# EAGLE design v1 (EAGLE 7.3.0)
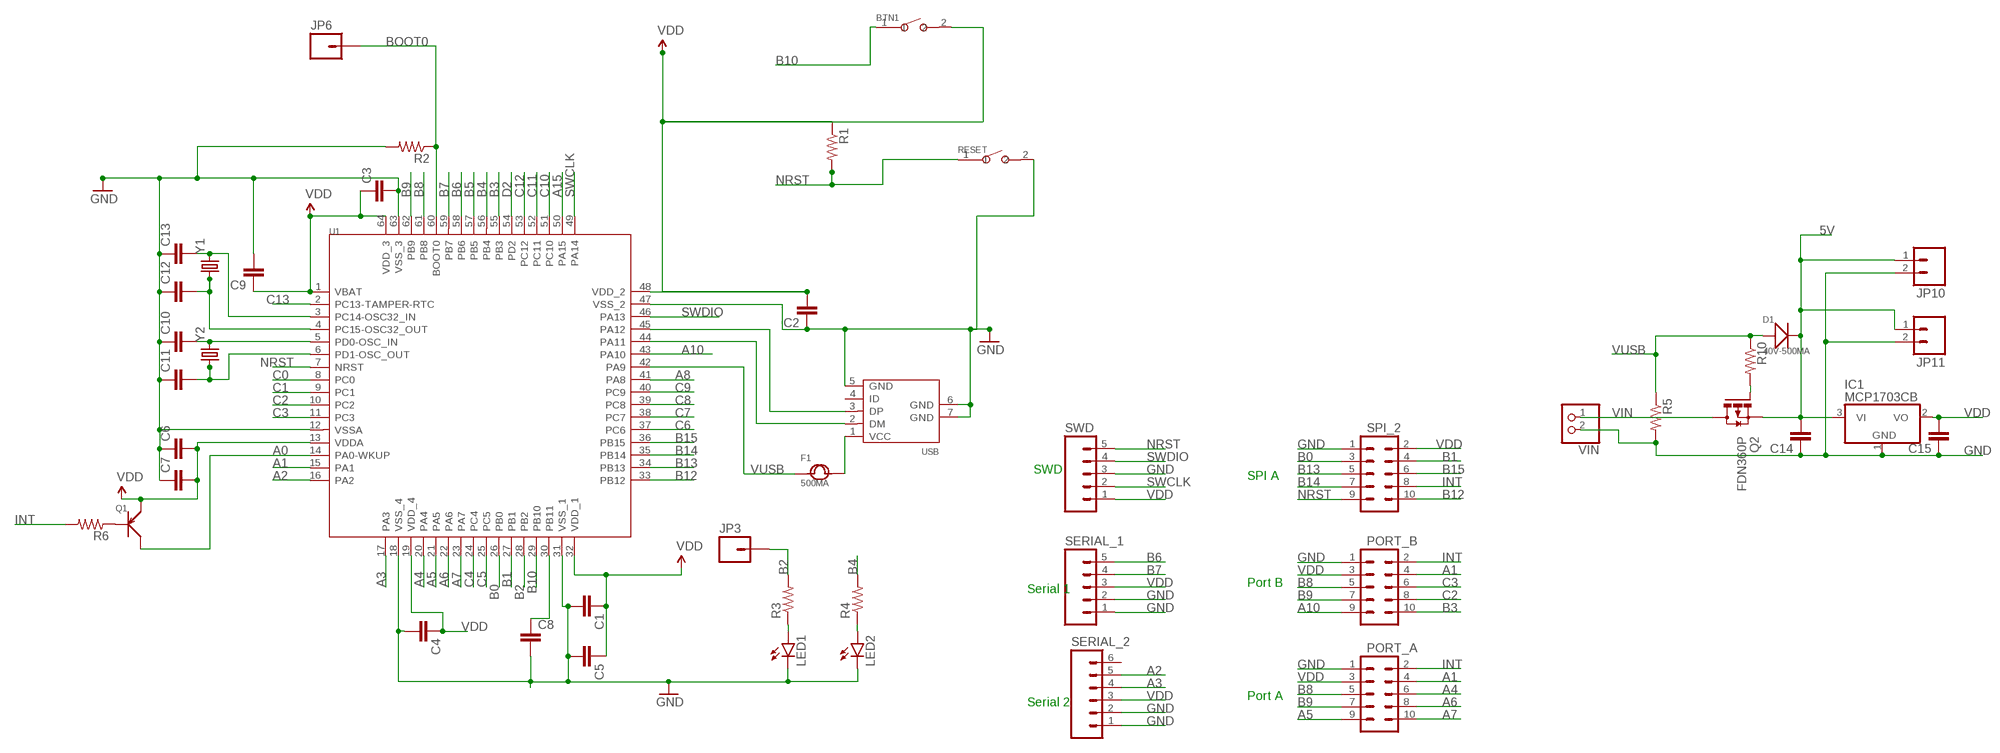
[diagram p0: schematic, sheet 1]

## Parts
BTN1  SMD-BUTTON(2P-6.0X3.0X2.5MM)-DHT-1163S  [SW2-4.0-6.0X3.0X2.5MM]
C1  CAP0805  [0805]
C2  CAP0805  [0805]
C3  CAP0805  [0805]
C4  CAP0805  [0805]
C5  CAP0805  [0805]
C6  CAP0805  [0805]
C7  CAP0805  [0805]
C8  CAP0805  [0805]
C9  CAP0805  [0805]
C10  CAP0805  [0805]
C11  CAP0805  [0805]
C12  CAP0805  [0805]
C13  CAP0805  [0805]
C14  CAP0805  [0805]
C15  CAP0805  [0805]
D1  40V-500MA  SMD-DIODE-SCHOTTKY-40V-500MA(SOD-123)  [SOD-123]
F1  500MA  SMD-PPTC-500MA(1206)  [F1206]
IC1  MCP1703CB  [SOT23]
JP3  M01NOSILK-KIT  [1X01NS-KIT]
JP6  M01NOSILK-KIT  [1X01NS-KIT]
JP10  M02PTH  [1X02]
JP11  M02PTH  [1X02]
LED1  LED1206  [LED-1206]
LED2  LED1206  [LED-1206]
PORT_A  M05X2PTH  [AVR_ICSP]
PORT_B  M05X2PTH  [AVR_ICSP]
Q1  SMD-TRANSISTORS-PNP-25V-500MA(SOT-23)  [SOT-23]
Q2  FDN360P  [SUPER-SOT3]
R1  RESISTOR0805-RES  [0805]
R2  RESISTOR0805-RES  [0805]
R3  RESISTOR0805-RES  [0805]
R4  RESISTOR0805-RES  [0805]
R5  RESISTOR0805-RES  [0805]
R6  RESISTOR0805-RES  [0805]
R10  RESISTOR0805-RES  [0805]
RESET  SMD-BUTTON(2P-6.0X3.0X2.5MM)-DHT-1163S  [SW2-4.0-6.0X3.0X2.5MM]
SERIAL_1  M051.27MM  [1X05-1.27MM]
SERIAL_2  M06SILK_FEMALE_PTH  [1X06]
SPI_2  M05X2PTH  [AVR_ICSP]
SWD  M051.27MM  [1X05-1.27MM]
U1  MCU-STM32F401RBT6(LQFP64)  [LQFP64-0.5-10X10MM]
USB  MICRO-USB-SMD-TYPE-AB-R/A(ST-USB-001L)  [MICRO-USB5+2P-SMD-0.65]
VIN  JST_2PIN-SMT-RA  [JST-PH-2-SMT-RA]
Y1  CRYSTAL5X3  [CRYSTAL-SMD-5X3]
Y2  CRYSTAL5X3  [CRYSTAL-SMD-5X3]

## Nets
5V: C14.2 D1.- IC1.3(VI) JP10.1 JP11.1 Q2.2(S)
A0: Q1.3(C) U1.14(PA0-WKUP)
A1: PORT_A.4 PORT_B.4 U1.15(PA1)
A2: SERIAL_2.5 U1.16(PA2)
A3: SERIAL_2.4 U1.17(PA3)
A4: PORT_A.6 U1.20(PA4)
A5: PORT_A.9 U1.21(PA5)
A6: PORT_A.8 U1.22(PA6)
A7: PORT_A.10 U1.23(PA7)
A8: U1.41(PA8)
A10: PORT_B.9 U1.43(PA10)
A15: U1.50(PA15)
B0: SPI_2.3 U1.26(PB0)
B1: SPI_2.4 U1.27(PB1)
B2: JP3.1 R3.2 U1.28(PB2)
B3: PORT_B.10 U1.55(PB3)
B4: R4.2 U1.56(PB4)
B5: U1.57(PB5)
B6: SERIAL_1.5 U1.58(PB6)
B7: SERIAL_1.4 U1.59(PB7)
B8: PORT_A.5 PORT_B.5 U1.61(PB8)
B9: PORT_A.7 PORT_B.7 U1.62(PB9)
B10: BTN1.1 U1.29(PB10)
B12: SPI_2.10 U1.33(PB12)
B13: SPI_2.5 U1.34(PB13)
B14: SPI_2.7 U1.35(PB14)
B15: SPI_2.6 U1.36(PB15)
BOOT0: JP6.1 R2.1 U1.60(BOOT0)
C0: U1.8(PC0)
C1: U1.9(PC1)
C2: PORT_B.8 U1.10(PC2)
C3: PORT_B.6 U1.11(PC3)
C4: U1.24(PC4)
C5: U1.25(PC5)
C6: U1.37(PC6)
C7: U1.38(PC7)
C8: U1.39(PC8)
C9: U1.40(PC9)
C10: U1.51(PC10)
C11: U1.52(PC11)
C12: U1.53(PC12)
C13: U1.2(PC13-TAMPER-RTC)
D2: U1.54(PD2)
GND: C1.2 C2.1 C3.2 C4.2 C5.2 C6.1 C7.1 C8.2 C9.2 C10.1 C11.1 C12.1 C13.1 C14.1 C15.1 IC1.1(GND) JP10.2 JP11.2 LED1.C LED2.C PORT_A.1 PORT_B.1 R2.2 R5.2 RESET.2 SERIAL_1.1 SERIAL_1.2 SERIAL_2.1 SERIAL_2.2 SPI_2.1 SWD.3 U1.12(VSSA) U1.18(VSS_4) U1.31(VSS_1) U1.47(VSS_2) U1.63(VSS_3) USB.5(GND) USB.6(GND) USB.7(GND) VIN.2
INT: PORT_A.2 PORT_B.2 R6.2 SPI_2.8
N$1: C13.2 U1.3(PC14-OSC32_IN) Y1.3
N$2: C8.1 U1.30(PB11)
N$3: C12.2 U1.4(PC15-OSC32_OUT) Y1.1
N$4: C10.2 U1.5(PD0-OSC_IN) Y2.3
N$5: C11.2 U1.6(PD1-OSC_OUT) Y2.1
N$6: U1.44(PA11) USB.2(DM)
N$7: U1.45(PA12) USB.3(DP)
N$8: Q1.1(B) R6.1
N$9: F1.2 USB.1(VCC)
N$10: LED1.A R3.1
N$11: LED2.A R4.1
N$14: Q2.1(G) R10.2
NRST: R1.2 RESET.1 SPI_2.9 SWD.5 U1.7(NRST)
SWCLK: SWD.2 U1.49(PA14)
SWDIO: SWD.4 U1.46(PA13)
VDD: BTN1.2 C1.1 C2.2 C3.1 C4.1 C5.1 C6.2 C7.2 C9.1 C15.2 IC1.2(VO) PORT_A.3 PORT_B.3 Q1.2(E) R1.1 SERIAL_1.3 SERIAL_2.3 SPI_2.2 SWD.1 U1.1(VBAT) U1.13(VDDA) U1.19(VDD_4) U1.32(VDD_1) U1.48(VDD_2) U1.64(VDD_3)
VIN: Q2.3(D) VIN.1
VUSB: D1.+ F1.1 R5.1 R10.1 U1.42(PA9)
Unconnected: SERIAL_2.6 USB.4(ID)

## Notes on the sheet
- SWD
- SPI A
- Port B
- Serial 1
- Port A
- Serial 2

## Library data of the parts
BTN1 RESET = Seeed-OPL-Switch:SMD-BUTTON(2P-6.0X3.0X2.5MM): 311020029
C1-C15 = SparkFun-Passives:CAP: Capacitor Standard 0603 ceramic capacitor, and 0.1" leaded capacitor.
D1 = Seeed-OPL-Diode:SMD-DIODE-SCHOTTKY-40V-500MA(SOD-123): 304020012; MPN: B0540W
F1 = Seeed-OPL-fuse:SMD-PPTC-500MA(1206): 307010002
IC1 = linear:MCP1703: 250 mA, 16V, Low Quiescent Current LDO Regulator Source: http://ww1.microchip.com/downloads/en/DeviceDoc/22049b.pdf
JP3 JP6 = SparkFun-Connectors:M01: Header 1 Standard 1-pin 0.1" header. Use with straight break away headers (SKU : PRT-00116), right angle break away headers (PRT-00553), swiss pins (PRT-00743), machine pins (PRT-00117), and female headers (PRT-00115).
JP10 JP11 = SparkFun-Connectors:M02: Standard 2-pin 0.1" header. Use with - straight break away headers ( PRT-00116) - right angle break away headers (PRT-00553) - swiss pins (PRT-00743) - machine pins (PRT-00117) - female headers (PRT-00115) Molex polarized connector foot print use with: PRT-08233 with associated crimp pins and housings. 2.54_SCREWTERM for use with PRT-10571. 3.5mm Screw Terminal footprints for PRT-08084 5mm Screw Terminal footprints for use with PRT-08432
LED1 LED2 = SparkFun-LED:LED: LEDs Standard schematic elements and footprints for 5mm, 3mm, 1206, and 0603 sized LEDs. 5mm - Spark Fun Electronics SKU : COM-00529 (and others)
PORT_A PORT_B SPI_2 = SparkFun-Connectors:M05X2: Header 5x2 Standard 10-pin dual row 0.1" header. Commonly used with AVR-ISP. Use with Spark Fun Electronics SKU: PRT-00778
Q1 = Seeed-OPL-Transistor:SMD-TRANSISTORS-PNP-25V-500MA(SOT-23): 305020006; MPN: S8550
Q2 = transistor-power:FDN360P: Single P-Channel, PowerTrench (R) MOSFET Source: http://www.fairchildsemi.com/ds/FD/FDN360P.pdf
R1-R6 R10 = SparkFun-Passives:RESISTOR: Resistor Basic schematic elements and footprints for 0603, 1206, and PTH resistors.
SERIAL_1 SWD = SparkFun-Connectors:M05: Header 5 Standard 5-pin 0.1" header. Use with straight break away headers (SKU : PRT-00116), right angle break away headers (PRT-00553), swiss pins (PRT-00743), machine pins (PRT-00117), and female headers (PRT-00115). Molex polarized connector foot print use with SKU : PRT-08230 with associated crimp pins and housings.
SERIAL_2 = SparkFun-Connectors:M06: Header 6 Standard 6-pin 0.1" header. Use with straight break away headers (SKU : PRT-00116), right angle break away headers (PRT-00553), swiss pins (PRT-00743), machine pins (PRT-00117), and female headers (PRT-00115). Molex polarized connector foot print use with SKU : PRT-08094 with associated crimp pins and housings. NOTES ON THE VARIANTS LOCK and LOCK_LONGPADS... This footprint was designed to help hold the alignment of a through-hole component (i.e. 6-pin header) while soldering it into place. You may notice that each hole has been shifted either up or down by 0.005 of an inch from it's more standard position (which is a perfectly straight line). This slight alteration caused the pins (the squares in the middle) to touch the edges of the holes. Because they are alternating, it causes a "brace" to hold the component in place. 0.005 has proven to be the perfect amount of "off-center" position when using our standard breakaway headers. Although looks a little odd when you look at the bare footprint, once you have a header in there, the alteration is very hard to notice. Also,if you push a header all the way into place, it is covered up entirely on the bottom side. This idea of altering the position of holes to aid alignment will be further integrated into the Sparkfun Library for other footprints. It can help hold any component with 3 or more connection pins.; PROD_ID: CONN-08437
U1 = Seeed-OPL-ic:MCU-STM32F401RBT6(LQFP64): 310010113; MPN: STM32F401RBT6
USB = Seeed-OPL-Connector:MICRO-USB-SMD-TYPE-AB-R/A(ST-USB-001L): 320010012; MPN: ST-USB-001L
VIN = adafruit:JST_2PIN: JST 2-Pin Connectors of various flavors SMT-RA (S2B-PH-SM4) 4UConnector #17311 SMT (B2B-PH-SM4) THM-RA (S2B-PH) THM (B2B-PH)
Y1 Y2 = SparkFun-FreqCtrl:CRYSTAL: Various standard crystals. Proven footprints.; PROD_ID: XTAL-08218

## Board
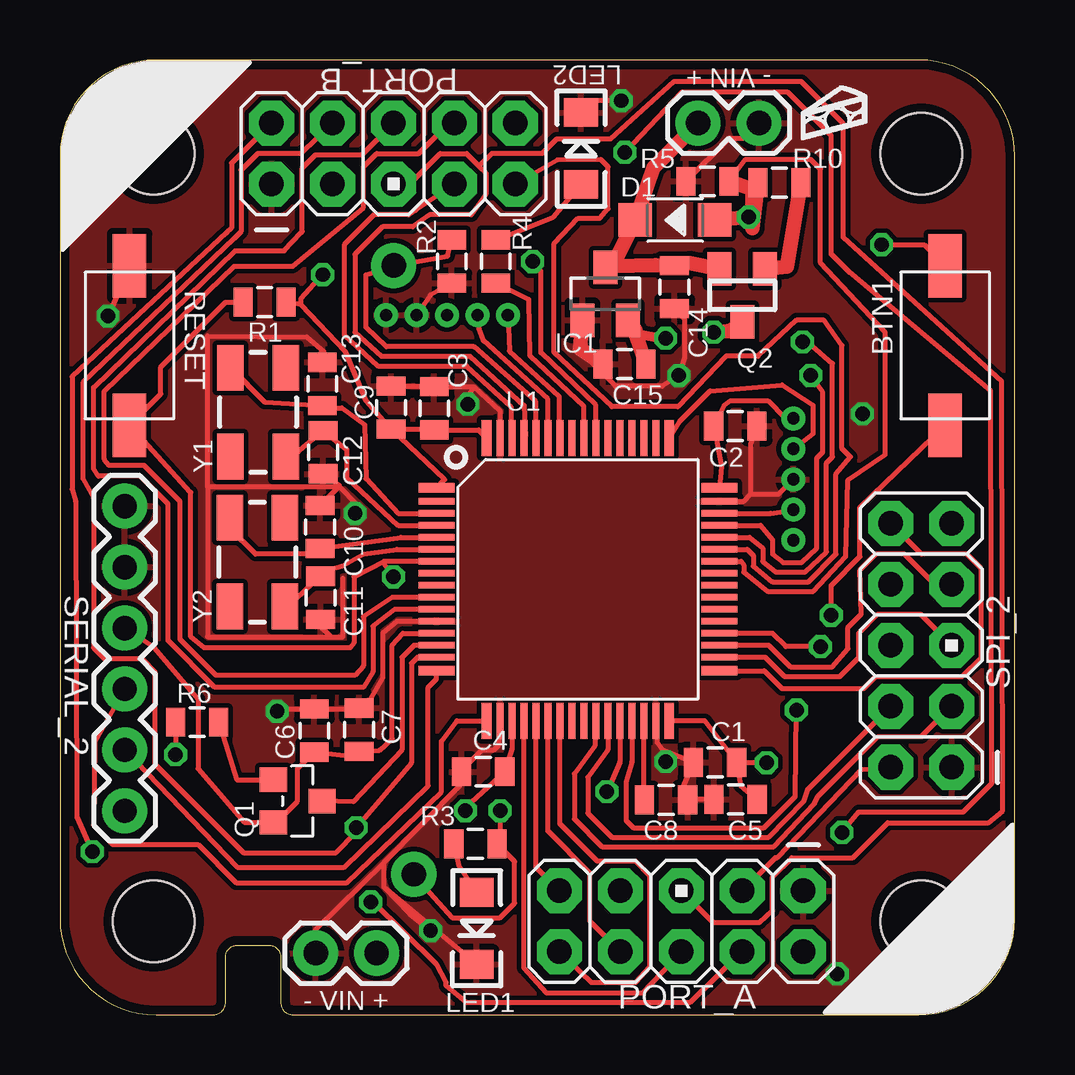
[diagram p1: board, top side]
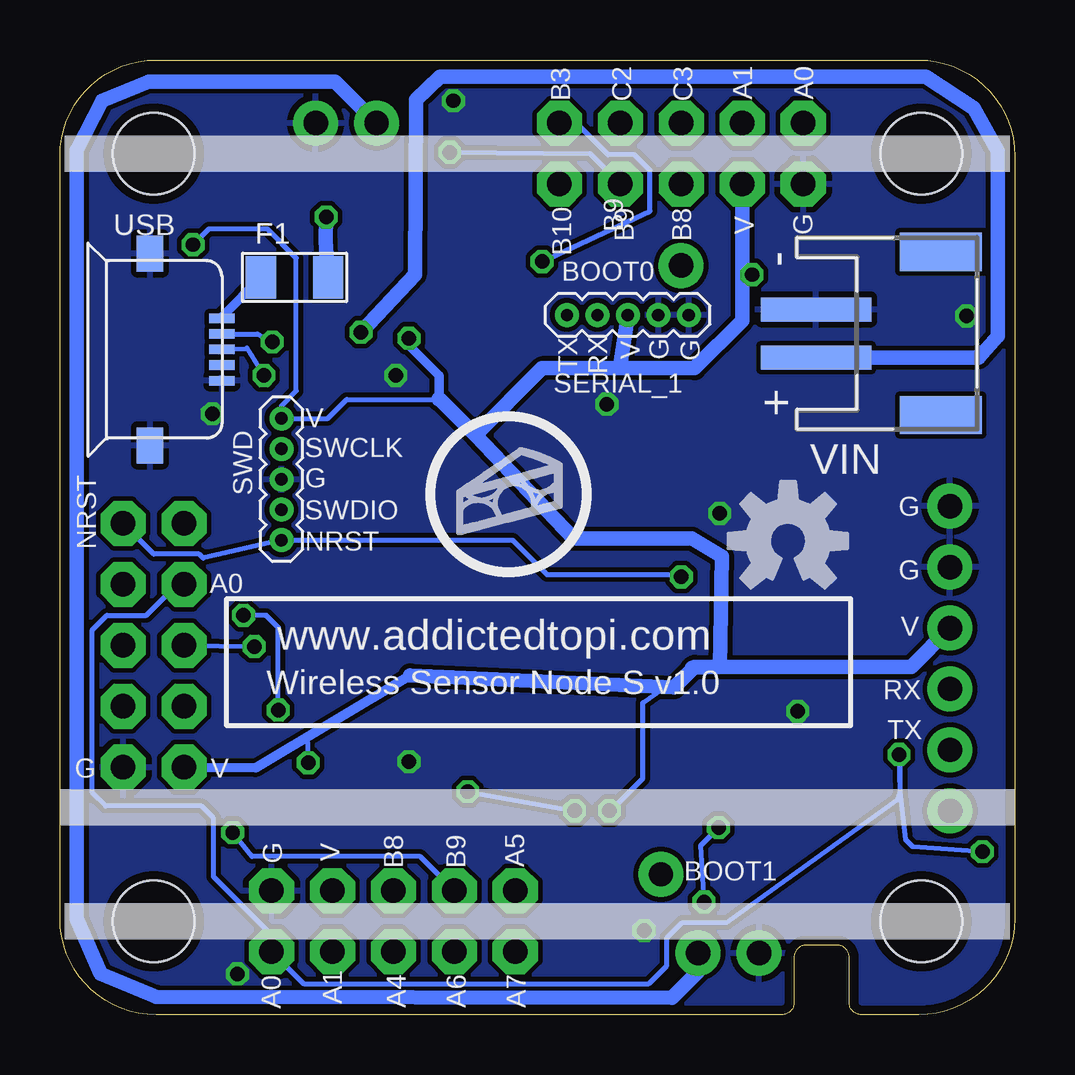
[diagram p2: board, bottom side, seen from below]

Size 39.8 x 39.8 mm. Coordinates in mm from the lower left corner, seen from the top.
Outline: 0,35.8 0,4 arc90 4,0 6.4,0 arc90 6.9,0.5 6.9,2.4 arc-90 7.4,2.9 8.7,2.9 arc-90 9.2,2.4 9.2,0.5 arc90 9.7,0 35.8,0 arc90 39.8,4 39.8,35.8 arc90 35.8,39.8 4,39.8 arc90 0,35.8
Copper layers (1*16): Top 0.0356mm / dielectric 1.5011mm / Bottom 0.0356mm
Design rules "LaenPCBOrder": minimum track width 6mil, minimum drill 13mil, track to track 6mil, track to pad 6mil, pad to pad 6mil, via to via 6mil, smd to smd 6mil, copper to edge 15mil, drill to drill 6mil, minimum pad ring 7mil, minimum via ring 7mil, stop-mask expansion 3mil, vias tented up to drill 0mil, thermal gap 10mil
Holes 3.4 mm at 3.9,3.9 35.9,3.9 35.9,35.9 3.9,35.9

### Footprints (pad centres in the part's own frame; a part is rotated, then mirrored left to right if it is on the bottom)
SW2-4.0-6.0X3.0X2.5MM = smd 2.65 x 1.4: 1 -3.325,0; 2 3.325,0
0805 = smd 0.8 x 1.2: 1 -0.9,0; 2 0.9,0
SOD-123 = smd 1.397 x 1.397: + -1.651,0; - 1.651,0
F1206 = smd 1.27 x 1.778: 1 -1.397,0; 2 1.397,0
SOT23 = smd 1 x 1.4: 1 -0.95,-1.1; 2 0.95,-1.1; 3 0,1.1
1X01NS-KIT = drill 1.016 pad 1.88: 1 0,0
1X02 = drill 1.016 pad 1.88: 1 0,0; 2 2.54,0
LED-1206 = smd 1.2 x 1.4: A -1.5,0; C 1.5,0
AVR_ICSP = drill 1.016 pad 1.88 octagon: 1 -1.27,5.08; 2 1.27,5.08; 3 -1.27,2.54; 4 1.27,2.54; 5 -1.27,0; 6 1.27,0; 7 -1.27,-2.54; 8 1.27,-2.54; 9 -1.27,-5.08; 10 1.27,-5.08
SOT-23 = smd 1.016 x 1.143: 1 -0.889,-1.016; 2 0.889,-1.016; 3 0,1.016
SUPER-SOT3 = smd 1 x 1.4: 1 -0.95,-1.1; 2 0.95,-1.1; 3 0,1.1
1X05-1.27MM = drill 0.508 pad 1: 1 0,0; 2 1.27,0; 3 2.54,0; 4 3.81,0; 5 5.08,0
1X06 = drill 1.016 pad 1.88: 1 0,0; 2 2.54,0; 3 5.08,0; 4 7.62,0; 5 10.16,0; 6 12.7,0
LQFP64-0.5-10X10MM = smd 1.5 x 0.4: 1 -5.9,3.81; 16 -5.9,-3.81; 33 5.9,-3.81; 48 5.9,3.81 | smd 1.5 x 0.28: 2 -5.9,3.25; 3 -5.9,2.75; 4 -5.9,2.25; 5 -5.9,1.75; 6 -5.9,1.25; 7 -5.9,0.75; 8 -5.9,0.25; 9 -5.9,-0.25; 10 -5.9,-0.75; 11 -5.9,-1.25; 12 -5.9,-1.75; 13 -5.9,-2.25; 14 -5.9,-2.75; 15 -5.9,-3.25; 34 5.9,-3.25; 35 5.9,-2.75; 36 5.9,-2.25; 37 5.9,-1.75; 38 5.9,-1.25; 39 5.9,-0.75; 40 5.9,-0.25; 41 5.9,0.25; 42 5.9,0.75; 43 5.9,1.25; 44 5.9,1.75; 45 5.9,2.25; 46 5.9,2.75; 47 5.9,3.25 | smd 0.4 x 1.5: 17 -3.81,-5.9; 32 3.81,-5.9; 49 3.81,5.9; 64 -3.81,5.9 | smd 0.28 x 1.5: 18 -3.25,-5.9; 19 -2.75,-5.9; 20 -2.25,-5.9; 21 -1.75,-5.9; 22 -1.25,-5.9; 23 -0.75,-5.9; 24 -0.25,-5.9; 25 0.25,-5.9; 26 0.75,-5.9; 27 1.25,-5.9; 28 1.75,-5.9; 29 2.25,-5.9; 30 2.75,-5.9; 31 3.25,-5.9; 50 3.25,5.9; 51 2.75,5.9; 52 2.25,5.9; 53 1.75,5.9; 54 1.25,5.9; 55 0.75,5.9; 56 0.25,5.9; 57 -0.25,5.9; 58 -0.75,5.9; 59 -1.25,5.9; 60 -1.75,5.9; 61 -2.25,5.9; 62 -2.75,5.9; 63 -3.25,5.9
MICRO-USB5+2P-SMD-0.65 = smd 0.4 x 1.05: 1 -1.3,0; 2 -0.65,0; 3 0,0; 4 0.65,0; 5 1.3,0 | smd 1.5 x 1.1: 6 4,-3; 7 -4,-3
JST-PH-2-SMT-RA = smd 1 x 4.6: 1 1,-3.7; 2 -1,-3.7 | smd 1.6 x 3.4: NC1 -3.4,1.5; NC2 3.4,1.5
CRYSTAL-SMD-5X3 = smd 1.9 x 1.1: 1 -1.85,-1.15; 2 1.85,-1.15; 3 1.85,1.15; 4 -1.85,1.15

### Placement (x,y rotation side)
BTN1  36.9,27.9 90 top
C1  27.31,10.52 180 top
C2  28.15,24.54 180 top
C3  15.6,25.28 90 top
C4  17.64,10.13 180 top
C5  28.16,8.98 180 top
C6  10.6,11.85 270 top
C7  12.47,11.88 270 top
C8  25.27,8.96 0 top
C9  13.8,25.31 90 top
C10  10.84,20.33 270 top
C11  10.86,17.38 90 top
C12  10.97,23.45 90 top
C13  10.94,26.3 270 top
C14  25.62,30.33 90 top
C15  23.53,27.12 0 top
D1  25.64,33.13 180 top
F1  30.02,30.74 180 bottom
IC1  22.73,30.05 0 top
JP3  14.75,5.85 0 top
JP6  13.91,31.23 0 top
JP10  26.6,37.17 0 top
JP11  13.2,2.57 180 top
LED1  17.37,3.6 270 top
LED2  21.72,36.11 90 top
PORT_A  25.9,3.9 270 top
PORT_B  13.9,35.9 90 top
Q1  9.91,8.91 270 top
Q2  28.44,29.99 180 top
R1  8.53,29.7 180 top
R2  16.33,31.4 270 top
R3  17.32,7.12 0 top
R4  18.17,31.4 270 top
R5  26.99,34.74 180 top
R6  5.72,12.2 180 top
R10  29.99,34.68 0 top
RESET  2.9,27.9 90 top
SERIAL_1  13.59,29.17 180 bottom
SERIAL_2  2.7,21.2 270 top
SPI_2  35.9,15.4 180 top
SWD  30.57,24.86 270 bottom
U1  21.59,18.15 0 top
U$1  [PI]  18.05,18.7 0 top
U$2  [OSHW-LOGO-M]  9.45,19.75 0 bottom
U$3  [PI_XS]  34.15,35.65 0 bottom
USB  33.05,27.73 270 bottom
VIN  4.58,28.4 270 bottom
Y1  8.26,25.12 90 top
Y2  8.23,18.87 90 top

### Tracks (layer width: path | path; a pad name or v marks a point on that pad's centre or on a via)
5V
  Top 0.6: JP10.1 24.74,35.31 D1.- 23.19,31.54 23.06,31.21 | Q2.2 26.26,31.34 C14.2 24.83,31.24 23.06,31.21 | IC1.3 23.06,31.21
  Bottom 0.6: JP10.1 28.33,38.9 36.1,38.9 38.05,38.1 39.1,36.05 39.1,4 38.1,1.7 35.8,0.75 14.3,0.7 13.2,1.8 JP11.1
A0
  Top 0.2: U1.14 14.75,15.4 14.25,14.9 14.25,11.05 12.23,8.88 Q1.3
A1  (via drill 0.6)
  Top 0.2: U1.15 14.9,14.9 14.65,14.65 14.65,10.5 v12.35,7.8 12.35,7.6 11.5,6.75 7.65,6.75 3.95,10.45 3.95,14.3 3.4,14.85 1.85,14.85 1.4,15.3 1.4,21.55 0.95,22.35 0.95,26.35 7.25,32.35 7.55,32.65 7.55,35.21 8.24,35.9 10.05,35.9 PORT_B.4 | PORT_A.4 26.25,0.5 16.95,0.5 16.1,1.2 16.1,1.35 15.7,2.1 13.05,4.7 v12.95,4.7
  Bottom 0.2: v12.35,7.8 13.1,7.05 v12.95,4.7
A2
  Top 0.2: SERIAL_2.5 7.39,6.15 11.85,6.15 15.35,9.55 15.35,13.65 15.69,13.99 U1.16
A3
  Top 0.2: SERIAL_2.4 1.45,11.38 1.4,7.9 2.2,7.1 5.75,7.1 7.35,5.5 11.95,5.5 15.9,9.3 15.9,11.4 16.55,12.25 U1.17
A4
  Top 0.2: PORT_A.6 24.27,0.9 20.3,0.9 19.34,1.96 U1.20
A5
  Top 0.2: PORT_A.9 19.84,6.15 U1.21
A6
  Top 0.2: PORT_A.8 22.1,3.89 22.1,5.9 20.34,7.66 U1.22
A7
  Top 0.2: PORT_A.10 22.15,1.35 24,1.35 24.6,2 24.6,5.8 24,6.4 22.4,6.4 20.84,7.96 U1.23
A10
  Top 0.2: U1.43 28.65,19.4 28.9,19.15 28.9,18.7 29.7,18.05 31.2,18.05 32.35,19.2 32.35,22.55 32.95,23.25 32.6,23.6 32.6,27.9 31.85,28.95 30.7,28.95 29.1,27.45 27.75,27.45 25.75,25.35 23,25.35 20.6,27.6 20.6,32.15 21.6,33.2 22.5,33.2 22.85,33.6 22.85,35.35 22.55,35.65 20.73,35.63 PORT_B.9
B0
  Top 0.2: U1.26 22.3,11.2 21.44,10.04 21.44,8.16 22.6,7 29.75,7 31.45,8.8 31.6,9.1 34.1,11.6 35.91,11.6 SPI_2.3
B1
  Top 0.2: U1.27 22.84,11.04 22,9.9 22,8.4 23,7.4 29.55,7.4 31,8.9 31.17,9.4 SPI_2.4
B2  (via drill 0.6)
  Top 0.2: U1.28 23.34,10.54 v22.8,9.3 | v18.35,8.5 18.35,7.2 18.42,7.22 R3.2 18.95,6.39 18.95,4.65 18.35,4.05 16.35,4.05 14.85,5.7 JP3.1
  Bottom 0.2: v22.8,9.3 v18.35,8.5
B3  (via drill 0.6)
  Top 0.2: U1.55 22.34,25.41 20.05,27.6 20.05,31 v19.7,31.4
  Bottom 0.2: v19.7,31.4 15.2,33.5 15.2,35.2 15.85,35.85 16.95,35.85 18.15,37.05 18.86,37.05 PORT_B.10
B4
  Top 0.2: U1.56 21.84,25.36 19.6,27.45 19.55,29.82 R4.2
B6
  Top 0.2: SERIAL_1.5 18.73,27.67 20.8,25.8 20.8,24.09 U1.58
B7
  Top 0.2: U1.59 20.34,25.66 17.65,28.1 17.47,28.6 SERIAL_1.4
B8
  Top 0.2: PORT_B.5 14.58,34.63 15.85,35.9 16.95,35.9 17.47,35.38 | 17.47,35.38 17.75,35.1 17.75,34.2 17.15,33.35 15.4,33.35 14.7,32.85 13.45,32.85 12.3,31.7 12.3,28.45 13.4,27.45 17.1,27.45 19.35,25.4 19.4,24.11 U1.61 | PORT_A.5 27.22,3.85 29.15,3.85 29.7,4.35 29.7,5.75 30.5,6.55 33.05,6.55 34.5,8 38.7,8 39.3,8.5 39.25,26.4 32.65,32.4 32.65,37.15 30.9,38.9 25.6,38.9 22.95,36.5 20.7,36.5 20.1,35.9 18,35.9 17.47,35.38
B9  (via drill 0.6)
  Top 0.2: PORT_B.7 14.83,33.53 14.55,33.35 13.1,33.35 11.85,32.1 11.85,28.35 13.25,27.05 16.95,27.05 18.8,25.35 18.8,24.09 U1.62 | v32.6,7.6 33,8.1 33.3,8.45 37.65,8.45 38.85,9.65 38.8,26 32.9,30.95 32.15,31.7 32.15,36.65 30.35,38.45 25.9,38.45 v23.55,35.95
  Bottom 0.2: PORT_A.7 24.79,6.6 31.8,6.6 v32.6,7.6 | v23.55,35.95 17.71,35.9 PORT_B.7
B10  (via drill 0.6)
  Top 0.2: U1.29 23.84,10.54 23.6,9.7 23.6,8.1 23.9,7.8 29.35,7.8 30.65,9.1 v30.7,12.7 | v32.15,16.65 32.15,17.9 33.35,19.1 33.35,21.17 BTN1.1
  Bottom 0.2: v30.7,12.7 30.7,16.15 31.2,16.65 v32.15,16.65
B12
  Top 0.2: U1.33 29.36,14.34 30.1,13.6 33.5,13.6 34,14.1 37.6,14.1 38.4,14.9 38.4,18.6 37.8,19.2 35.91,19.2 SPI_2.10
B13
  Top 0.2: U1.34 29.4,14.9 30.2,14.1 32.5,14.1 33.3,14.9 33.3,15.9 34.1,16.7 35.87,16.7 SPI_2.5
B14
  Top 0.2: U1.35 29.55,15.4 30.45,14.5 32.2,14.5 32.85,15.25 32.85,16.15 33.4,16.7 33.35,18.55 34,19.2 35.2,19.2 36.46,17.94 SPI_2.7
B15  (via drill 0.6)
  Top 0.2: v31.7,15.35 30.25,15.35 29.7,15.9 U1.36
  Bottom 0.2: SPI_2.6 v31.7,15.35
BOOT0
  Top 0.2: U1.60 19.84,25.56 17.25,27.85 13.6,27.85 12.75,28.65 12.75,30.85 13.93,31.18 JP6.1 16.16,31.63 R2.1
C2
  Top 0.2: U1.10 13.85,17.4 12.65,16.6 12.65,14.55 12.3,14.15 6.5,14.15 5,15.65 5,21.4 3.5,22.9 2.05,22.9 1.85,23.15 1.85,26 7.25,31.2 9.7,31.2 12.65,33.65 12.65,35.35 13.2,35.9 14.95,35.9 16.22,37.17 PORT_B.8
C3
  Top 0.2: U1.11 13.95,16.9 13.05,16.2 13.05,14.3 12.65,13.65 6.45,13.65 4.5,15.6 4.5,21.3 3.35,22.45 1.6,22.45 1.4,22.75 1.4,26.15 7.3,31.85 9.35,31.85 10.05,32.6 10.1,32.65 10.1,35.3 10.65,35.85 12.6,35.85 13.9,37.15 PORT_B.6
GND  (via drill 0.6)
  Top 0.2: 11.61,22 6.15,22 | 6.15,22 6.15,28.3 10.3,28.25 11,27.65 10.84,27.55 C13.1 | 6.15,22 6.15,15.75 11.3,15.75 | 11.3,15.75 11.8,15.75 11.8,18.2 | U1.47 28.5,21.4 28.8,21.7 | 28.8,21.7 28.8,23.79 C2.1 | U1.12 14.05,16.4 13.45,15.9 13.45,14.05 12.9,13.1 | U1.18 18.3,12.21 18.3,11.25 18.1,11.05 17.6,11.05 16.69,10.14 C4.2 16.69,9.59 13.5,6.35 | 12.9,13.1 12.58,12.78 C7.1 12.44,12.75 C6.1 9.15,12.75 v9.05,12.65 | 12.9,13.1 12.8,13.1 12.45,12.75 | 11.65,22 11.65,22.07 C12.1 | 11.65,22 11.61,22 | 11.61,22 C10.1 | C11.1 10.86,16.19 11.3,15.75 | U1.63 18.34,25.19 17.25,26.18 | C9.2 15.67,26.21 C3.2 17.25,26.18 | R2.2 15.44,30 SERIAL_1.2 | RESET.2 v2,29.12 | 28.8,21.7 29.95,21.7 SWD.3 | 25.13,11.02 C1.2 25.86,9.27 C8.2 26.19,8.98 C5.2 | 25.13,11.02 24.9,11.35 24.9,12.19 U1.31 | 25.13,11.02 25.13,10.67 v25.25,10.55 | JP11.2 10.66,3.56 13.5,6.35 | LED1.C 13.5,5.32 | 13.5,5.32 13.5,6.35 | 11.65,22 12.35,21.3 v12.3,20.9 | C15.1 22.18,27.17 23.15,26.2 25.1,26.2 v25.8,26.65 26.05,27.4 26.05,29 C14.1 | 13.5,5.32 14.58,4.2 v15.45,3.5 | 17.25,26.18 17,25.78 v17,25.45 | R5.2 27.9,36.55 28.52,36.55 JP10.2 | v23.4,38.1 22.21,38.1 LED2.C
  Top 0.6: IC1.1 21.68,27.77 C15.1
  other vias: 33.45,25.05 32.4,1.7
  pour Bottom (isolate 0.2): 0.1,39.7 39.7,39.8 39.7,0.1 0.1,0.1
  pour Top (isolate 0.2): 39.5,0.3 39.5,39.6 39.7,39.8 0.4,39.8 0.2,39.6 0.2,0.3 0.3,0.2
INT  (via drill 0.6)
  Top 0.2: PORT_B.2 7.15,35.5 7.15,32.8 6.95,32.6 0.5,26.6 0.5,21.9 0.65,21.4 0.7,8.25 v1.35,6.8 | R6.2 v4.82,10.85
  Bottom 0.2: SPI_2.8 34.91,17.94 36.2,16.65 37.85,16.65 38.45,16.05 38.45,9.25 37.9,8.7 33.9,8.7 33.4,8.2 33.4,5.75 30.98,3.33 PORT_A.2 29.65,1.3 15.25,1.3 14.5,2.05 14.5,3.2 13.85,3.85 12,3.85 4.87,8.98 4.77,9.28 | 4.77,9.28 4.77,10.65 v4.82,10.85 4.77,9.28 | v1.35,6.8 4.25,7 4.55,7.3 4.77,9.28
N$1
  Top 0.2: Y1.3 8.53,25.55 C13.2 11.14,25.3 11.75,25.3 12.7,24.6 12.75,22.35 14.1,20.9 U1.3
N$2
  Top 0.2: C8.1 24.34,9.53 U1.30
N$3
  Top 0.2: Y1.1 9.69,23.27 C12.2 11.95,23.57 11.95,22.4 14.1,20.4 U1.4
N$4
  Top 0.2: Y2.3 7.08,20.27 8.15,19.2 10.76,19.2 C10.2 14.21,19.9 U1.5
N$5
  Top 0.2: Y2.1 9.5,17.02 C11.2 10.98,18.5 11.75,18.7 12.65,19.2 14.05,19.4 U1.6
N$6  (via drill 0.6)
  Top 0.2: U1.44 28.75,19.9 29.3,19.45 29.3,18.9 29.85,18.45 31.05,18.45 31.95,19.3 31.95,23 32.2,23.25 32.2,27.15 31.35,27.9 v30.95,28.05
  Bottom 0.2: USB.2 31.57,28.38 v30.95,28.05
N$7  (via drill 0.6)
  Top 0.2: U1.45 29.2,20.4 29.7,19.8 29.7,19.2 30.15,18.85 30.9,18.85 31.55,19.45 31.55,23.2 31.8,23.45 31.8,25.95 v31.3,26.65
  Bottom 0.2: v31.3,26.65 32,27.8 32,27.75 33.02,27.7 USB.3
N$8
  Top 0.2: R6.1 7.37,9.8 Q1.1
N$9
  Bottom 0.4: USB.1 33.05,29.11 F1.2
N$10
  Top 0.2: R3.1 16.62,6.22 LED1.A
N$11
  Top 0.2: R4.1 20.57,33.25 LED2.A
N$14
  Top 0.6: Q2.1 30.3,31.19 R10.2
NRST  (via drill 0.6)
  Top 0.2: U1.7 13.5,18.9 | 13.5,18.9 12.25,18.25 12.25,15.5 12.1,15.3 6,15.3 5.45,15.75 5.45,21.77 RESET.1 4.2,25.88 4.2,27 6.9,29.7 R1.2 | 13.5,18.9 13.5,18.8 v13.9,18.25
  Bottom 0.2: SPI_2.9 35.89,19.2 34,19.2 33.83,19.03 SWD.5 20.93,19.78 19.5,18.35 13.95,18.35 v13.9,18.25
SWCLK
  Top 0.2: SWD.2 31.4,24.22 31.4,25.4 30.1,26.25 27.1,26 25.85,24.75 U1.49
SWDIO
  Top 0.2: U1.46 29.62,20.9 SWD.4
VDD  (via drill 0.6)
  Top 0.2: U1.48 27.58,22.85 C2.2 27.69,25.41 27.95,25.6 29.5,25.6 30.22,24.88 SWD.1 | U1.19 18.84,11.08 C4.1 16.9,8.64 v16.9,8.5 | C6.2 12.41,10.75 C7.2 13.32,11.02 13.85,11.5 13.85,15.4 14.3,15.9 U1.13 | U1.1 16.04,22.31 C9.1 | SERIAL_2.3 3.93,15.32 5.6,13.35 5.75,13.15 5.75,10.25 7.68,8.02 Q1.2 9.02,8.02 9.9,8.9 9.9,10.25 C6.2 | C6.2 10.83,10.88 | C1.1 28.36,9.57 C5.1 | C1.1 26.88,12.25 U1.32 | C9.1 15.67,24.41 C3.1 17.45,24.38 U1.64 | PORT_A.3 29.82,6.55 29.9,6.55 33.42,10.22 SPI_2.2 | C9.1 12.75,25.61 11.9,27.65 10.05,29.6 | 10.05,29.6 R1.1 | 10.05,29.6 10.05,29.85 v10.95,30.85 | C1.1 29.43,10.52 v29.45,10.5 | v34.25,32.1 36.02,32.1 BTN1.2
  Top 0.4: v25.25,28.2 24.75,28.25 23.98,28.4
  Top 0.6: IC1.2 23.98,28.55 23.98,28.4 C15.2
  Bottom 0.2: 11.36,28.94 11.36,30.44 v10.95,30.85 | 25.2,14.15 29.5,11.65 v29.45,10.5 | 24.02,25.58 24.09,25.65 27.85,25.65 28.64,24.86 SWD.1 30.57,25.38 29.95,26 29.95,31.55 31.15,32.75 33.6,32.75 v34.25,32.1 | v16.9,8.5 16.85,8.5 15.5,9.85 15.5,13 13.45,14.45
  Bottom 0.4: 25.2,14.15 31.65,10.3 33.82,10.32 SPI_2.2 | 24.02,25.58 24.01,25.66 24,25.8 24,26.65 25.25,27.9 v25.25,28.2
  Bottom 0.6: 22.47,24.17 23.95,25.65 24.01,25.65 24.01,25.66 | 22.47,24.17 18.4,19.85 13.45,19.85 12.2,19.1 12.3,14.5 | 12.3,14.5 13.45,14.45 13.35,14.5 | 13.35,14.5 12.3,14.5 | 12.3,14.5 4.32,14.5 SERIAL_2.3 | PORT_B.3 11.36,28.94 13.35,26.95 16.25,26.95 | 16.25,26.95 19.7,26.95 22.47,24.17 | SERIAL_1.3 16.43,27.13 16.25,26.95 | 25.2,14.15 14.2,13.65 13.35,14.5
VIN  (via drill 0.6)
  Top 0.6: v27.25,28.45 27.85,28.5 27.94,28.49 Q2.3
  Bottom 0.6: VIN.1 1.5,27.4 0.7,28.3 0.7,36 1.7,37.8 3.7,39.1 23.95,39.1 24.95,38.15 25,30.85 v27.25,28.45
VUSB  (via drill 0.6)
  Top 0.2: U1.42 28.4,18.9 28.5,18.75 28.5,18.45 29.5,17.65 31.4,17.65 32.75,19.1 32.85,22.3 34.4,23.35 34.4,28.45 31.7,31.35 31.7,35.25 31.3,35.65 28.56,35.64 R5.1
  Top 0.6: 28.87,32.8 v28.7,33.25 27.7,33.17 D1.+ | 28.87,32.8 R10.1 | 28.87,32.8 28.87,34.42 R5.1
  Bottom 0.6: F1.1 28.72,32.28 v28.7,33.25

### Text on the board
tNames: - VIN + | - VIN +
bNames: C3 | C2 | B3 | A0 | A1 | G | B8 | B9 | B9 | B10 | V | BOOT0 | G | G | V | RX | TX | V | G | SWCLK | G | SWDIO | NRST | NRST | G | A0 | V | www.addictedtopi.com | RX | Wireless Sensor Node S v1.0 | TX | V | G | BOOT1 | A5 | B9 | B8 | V | G | A7 | A6 | A4 | A1 | A0